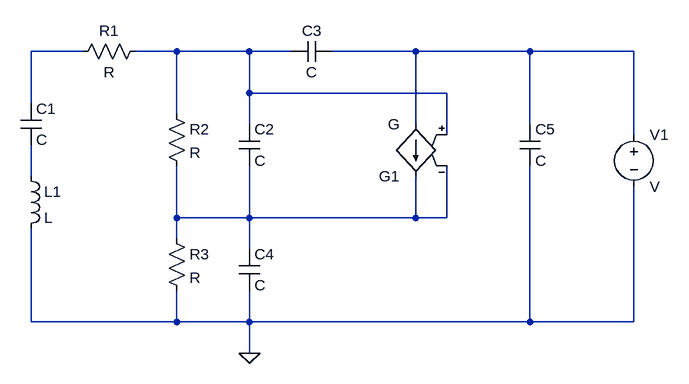
[diagram p0: schematic draft1_noCollector.asc]
draft1_noCollector.asc, the LTspice schematic file:
Version 4
SHEET 1 880 680
WIRE -432 -192 -512 -192
WIRE -288 -192 -352 -192
WIRE -176 -192 -288 -192
WIRE -112 -192 -176 -192
WIRE 80 -192 -48 -192
WIRE 256 -192 80 -192
WIRE 416 -192 256 -192
WIRE -176 -128 -176 -192
WIRE 128 -128 -176 -128
WIRE -512 -112 -512 -192
WIRE -288 -96 -288 -192
WIRE -176 -80 -176 -128
WIRE 80 -80 80 -192
WIRE 256 -80 256 -192
WIRE 128 -64 128 -128
WIRE 416 -64 416 -192
WIRE -512 0 -512 -48
WIRE -288 64 -288 -16
WIRE -176 64 -176 -16
WIRE -176 64 -288 64
WIRE 80 64 80 0
WIRE 80 64 -176 64
WIRE 128 64 128 -16
WIRE 128 64 80 64
WIRE -288 96 -288 64
WIRE -176 112 -176 64
WIRE -512 224 -512 80
WIRE -288 224 -288 176
WIRE -288 224 -512 224
WIRE -176 224 -176 176
WIRE -176 224 -288 224
WIRE 256 224 256 -16
WIRE 256 224 -176 224
WIRE 416 224 416 16
WIRE 416 224 256 224
WIRE -176 272 -176 224
FLAG -176 272 0
SYMBOL g2 80 16 R180
SYMATTR InstName G1
SYMBOL res -336 -208 R90
WINDOW 0 0 56 VBottom 2
WINDOW 3 32 56 VTop 2
SYMATTR InstName R1
SYMBOL cap -528 -112 R0
SYMATTR InstName C1
SYMBOL ind -528 -16 R0
SYMATTR InstName L1
SYMBOL res -304 -112 R0
SYMATTR InstName R2
SYMBOL cap -192 -80 R0
SYMATTR InstName C2
SYMBOL cap -48 -208 R90
WINDOW 0 0 32 VBottom 2
WINDOW 3 32 32 VTop 2
SYMATTR InstName C3
SYMBOL cap -192 112 R0
SYMATTR InstName C4
SYMBOL cap 240 -80 R0
SYMATTR InstName C5
SYMBOL res -304 80 R0
SYMATTR InstName R3
SYMBOL voltage 416 -80 R0
SYMATTR InstName V1

The netlist it stands for:
* draft1_noCollector.asc
G1 N003 N005 N002 N005 G
R1 N002 N001 R
C1 N001 N004 C
L1 N004 0 L
R2 N002 N005 R
C2 N002 N005 C
C3 N003 N002 C
C4 N005 0 C
C5 N003 0 C
R3 N005 0 R
V1 N003 0 V
.backanno
.end